# EAGLE design pi3_hat (EAGLE 6.5.0)
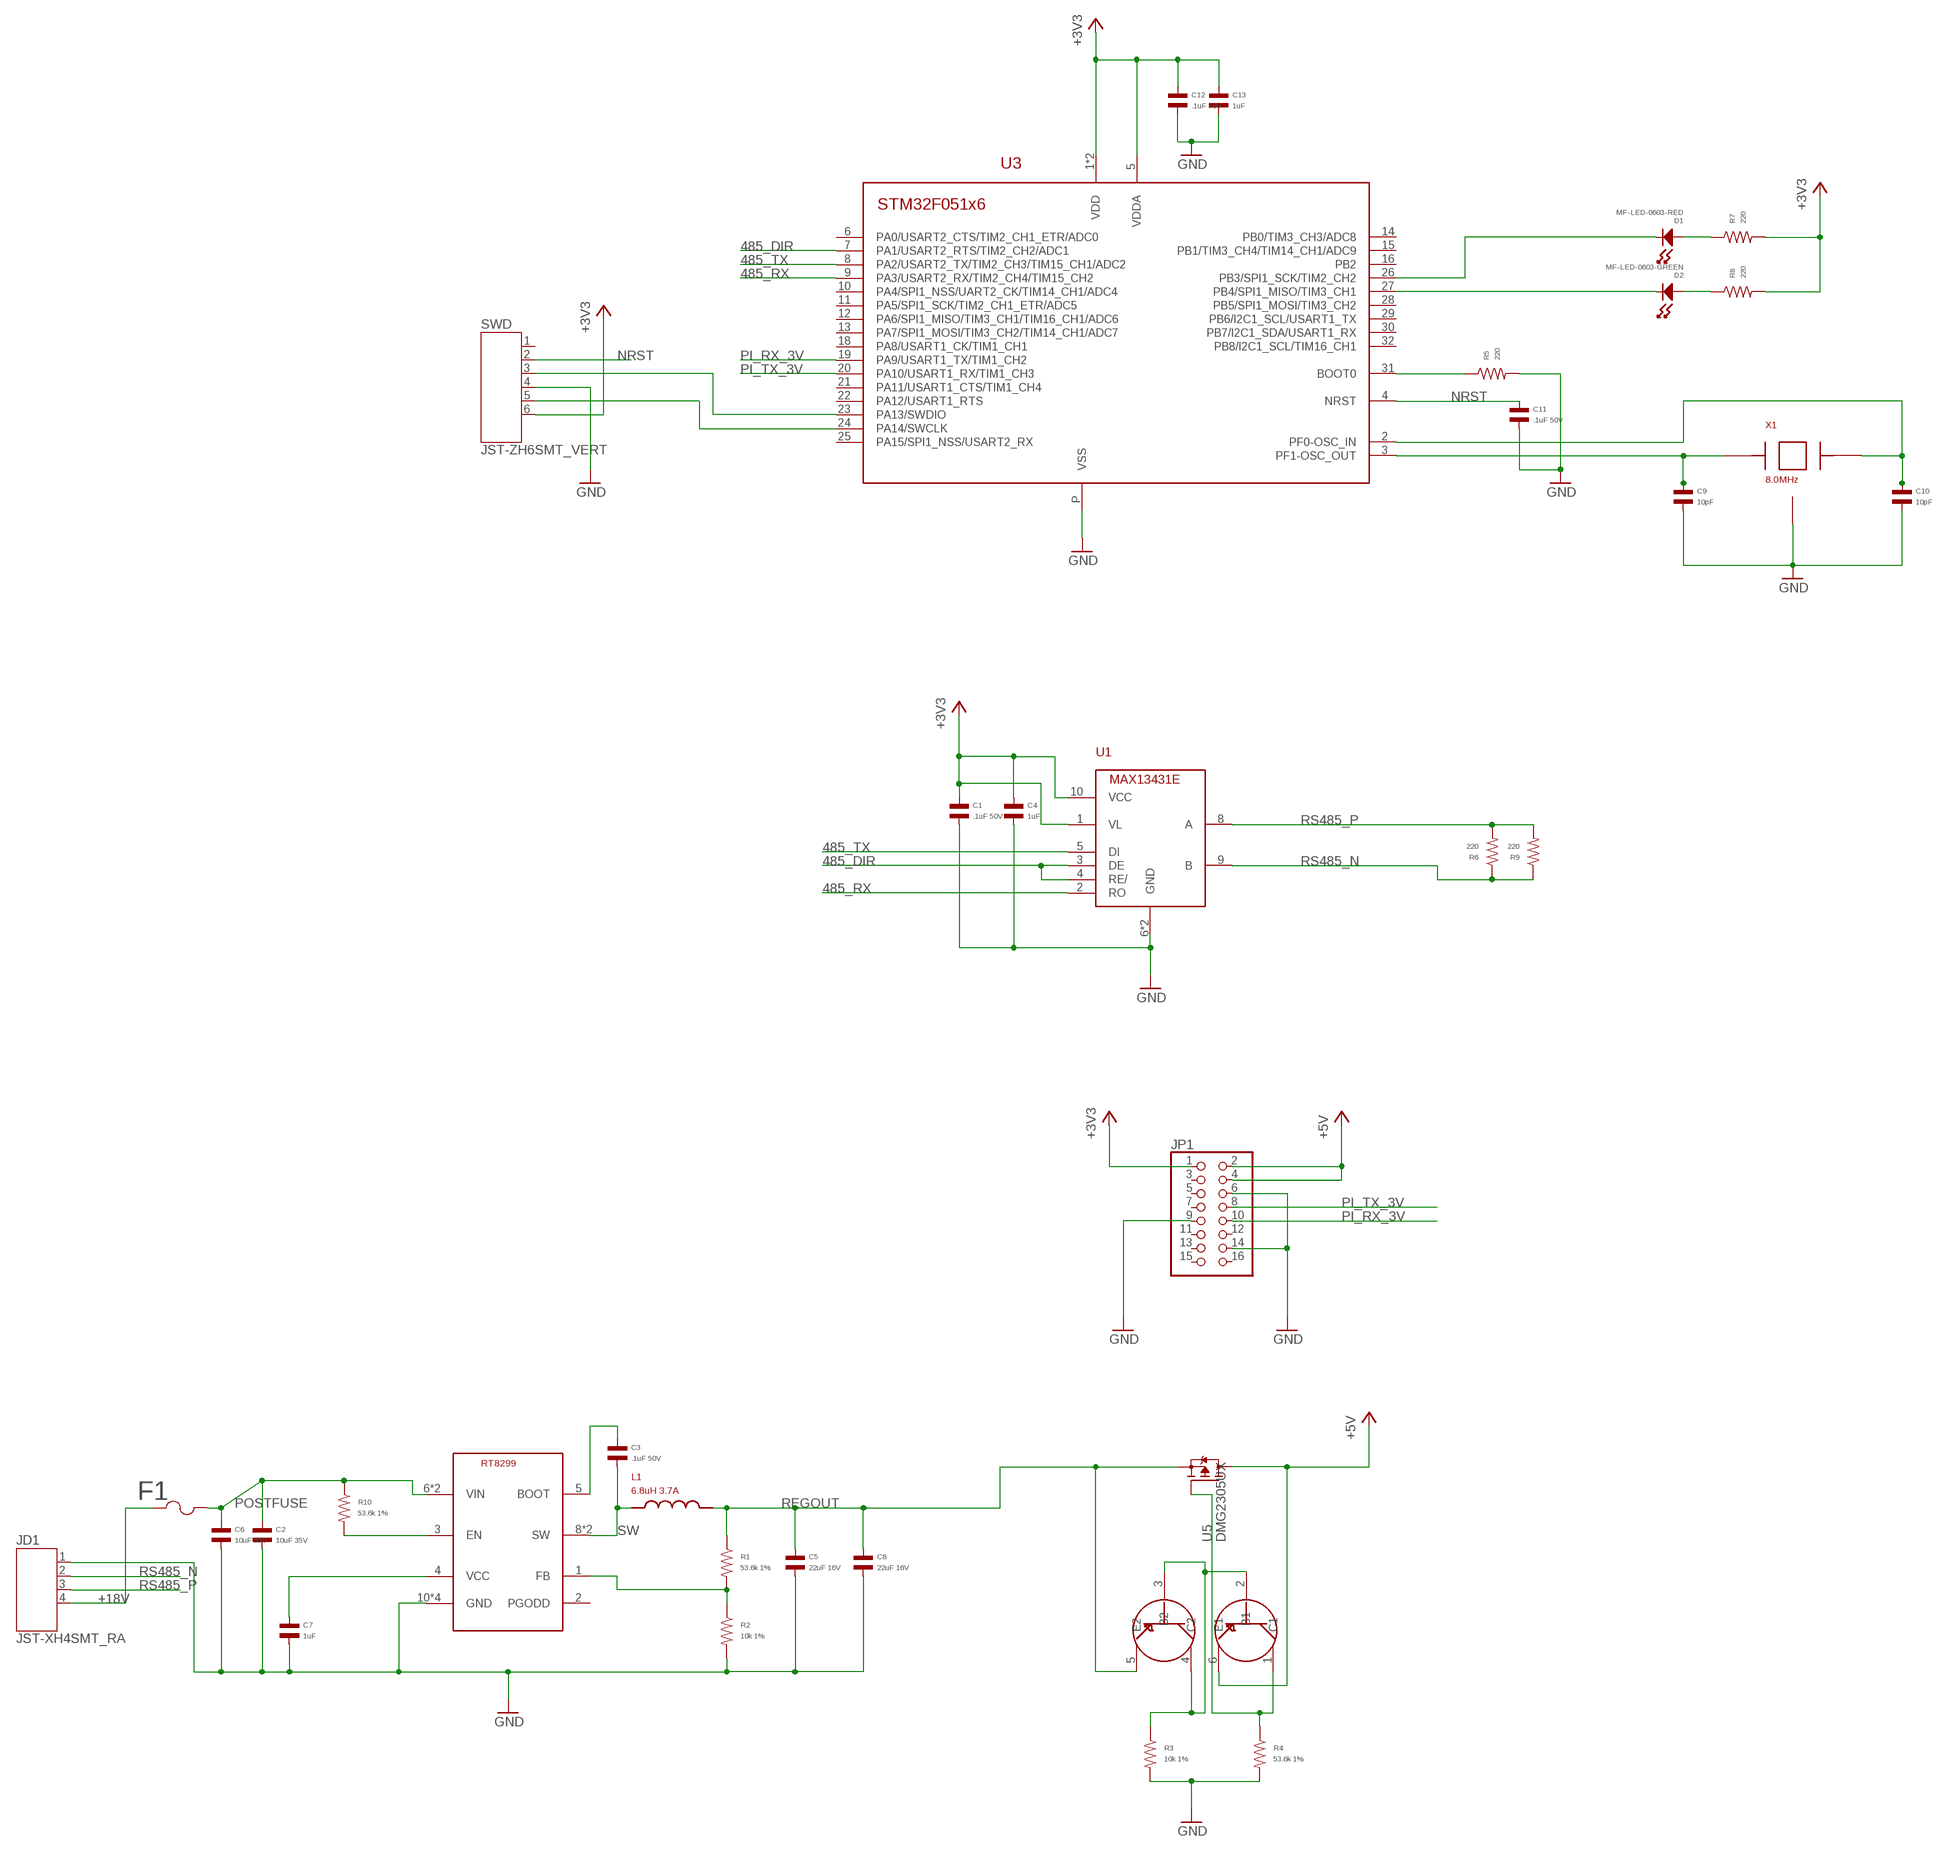
[diagram p0: schematic, sheet 1]

## Parts
C1  .1uF 50V  CAPACITOR_NP_0805  [C0805]
C2  10uF 35V  CAPACITOR_NP_1206  [C1206]
C3  .1uF 50V  CAPACITOR_NP_0805  [C0805]
C4  1uF  CAPACITOR_NP_0603  [C0603]
C5  22uF 16V  CAPACITOR_NP_1210  [C1210]
C6  10uF 35V  CAPACITOR_NP_1206  [C1206]
C7  1uF  CAPACITOR_NP_0603  [C0603]
C8  22uF 16V  CAPACITOR_NP_1210  [C1210]
C9  10pF  CAPACITOR_NP_0603  [C0603]
C10  10pF  CAPACITOR_NP_0603  [C0603]
C11  .1uF 50V  CAPACITOR_NP_0805  [C0805]
C12  .1uF 50V  CAPACITOR_NP_0805  [C0805]
C13  1uF  CAPACITOR_NP_0603  [C0603]
D1  MF-LED-0603-RED  LED_SINGLE-0603-RED  [LED0603]
D2  MF-LED-0603-GREEN  LED_SINGLE-0603-GREEN  [LED0603]
F1  MFU0603FF04000P100  [FUS_VISHAY_MFU0603]
JD1  JST-XH4SMT_RA  [JST_XH_SMT_RA_4]
JP1  PINHD-2X8  [2X08]
L1  6.8uH 3.7A  INDUCTORTAIYO_8040  [TAIYO_8040]
R1  53.6k 1%  RESISTOR_0603  [R0603]
R2  10k 1%  RESISTOR_0603  [R0603]
R3  10k 1%  RESISTOR_0603  [R0603]
R4  53.6k 1%  RESISTOR_0603  [R0603]
R5  220  RESISTOR_0603  [R0603]
R6  220  RESISTOR_0603  [R0603]
R7  220  RESISTOR_0603  [R0603]
R8  220  RESISTOR_0603  [R0603]
R9  220  RESISTOR_0603  [R0603]
R10  53.6k 1%  RESISTOR_0603  [R0603]
SWD  JST-ZH6SMT_VERT  [JST_B6B-ZR-SM4-TF(LF)(SN)]
U1  MAX13431E  [TDFN10]
U2  RT829910L_DFN  [10L_DFN]
U3  STM32F051X6UFQFPN32  [UFQFPN32]
U4  DMMT5401  [SOT26]
U5  DMG2305UX  [SOT23]
X1  8.0MHz  CRYSTALABM3B  [ABM3B]

## Nets
485_DIR: U1.3(DE) U1.4(RE/) U3.7(PA1/USART2_RTS/TIM2_CH2/ADC1)
485_RX: U1.2(RO) U3.9(PA3/USART2_RX/TIM2_CH4/TIM15_CH2)
485_TX: U1.5(DI) U3.8(PA2/USART2_TX/TIM2_CH3/TIM15_CH1/ADC2)
+3V3: C1.P$1 C4.P$1 C12.P$1 C13.P$1 JP1.1 R7.P$2 R8.P$2 SWD.6 U1.1(VL) U1.10(VCC) U3.1(VDD) U3.5(VDDA) U3.17(VDD)
+5V: JP1.2 JP1.4 U4.6(E1) U5.3(D)
+18V: F1.1 JD1.4
GND: C1.P$2 C2.P$2 C4.P$2 C5.P$2 C6.P$2 C7.P$2 C8.P$2 C9.P$2 C10.P$2 C11.P$2 C12.P$2 C13.P$2 JD1.1 JP1.6 JP1.9 JP1.14 R2.P$2 R3.P$2 R4.P$2 R5.P$2 SWD.4 U1.6(GND) U1.PAD(GND) U2.10(GND) U2.P0(GND) U2.P1(GND) U2.P2(GND) U3.P(VSS) X1.2 X1.4
N$1: R3.P$1 U4.2(B1) U4.3(B2) U4.4(C2)
N$2: C7.P$1 U2.4(VCC)
N$4: R5.P$1 U3.31(BOOT0)
N$5: R4.P$1 U4.1(C1) U5.1(G)
N$7: R10.P$2 U2.3(EN)
N$8: C3.P$1 U2.5(BOOT)
N$11: R1.P$2 R2.P$1 U2.1(FB)
N$12: SWD.5 U3.24(PA14/SWCLK)
N$13: SWD.3 U3.23(PA13/SWDIO)
N$15: D1.ANODE R7.P$1
N$16: D2.ANODE R8.P$1
N$17: D1.CATHODE U3.26(PB3/SPI1_SCK/TIM2_CH2)
N$18: D2.CATHODE U3.27(PB4/SPI1_MISO/TIM3_CH1)
N$35: C9.P$1 U3.3(PF1-OSC_OUT) X1.1
N$36: C10.P$1 U3.2(PF0-OSC_IN) X1.3
NRST: C11.P$1 SWD.2 U3.4(NRST)
PI_RX_3V: JP1.10 U3.19(PA9/USART1_TX/TIM1_CH2)
PI_TX_3V: JP1.8 U3.20(PA10/USART1_RX/TIM1_CH3)
POSTFUSE: C2.P$1 C6.P$1 F1.2 R10.P$1 U2.6(VIN) U2.7(VIN)
REGOUT: C5.P$1 C8.P$1 L1.2 R1.P$1 U4.5(E2) U5.2(S)
RS485_N: JD1.2 R6.P$1 R9.P$1 U1.9(B)
RS485_P: JD1.3 R6.P$2 R9.P$2 U1.8(A)
SW: C3.P$2 L1.1 U2.8(SW) U2.9(SW)
Unconnected: JP1.3 JP1.5 JP1.7 JP1.11 JP1.12 JP1.13 JP1.15 JP1.16 SWD.1 U2.2(PGODD) U3.6(PA0/USART2_CTS/TIM2_CH1_ETR/ADC0) U3.10(PA4/SPI1_NSS/UART2_CK/TIM14_CH1/ADC4) U3.11(PA5/SPI1_SCK/TIM2_CH1_ETR/ADC5) U3.12(PA6/SPI1_MISO/TIM3_CH1/TIM16_CH1/ADC6) U3.13(PA7/SPI1_MOSI/TIM3_CH2/TIM14_CH1/ADC7) U3.14(PB0/TIM3_CH3/ADC8) U3.15(PB1/TIM3_CH4/TIM14_CH1/ADC9) U3.16(PB2) U3.18(PA8/USART1_CK/TIM1_CH1) U3.21(PA11/USART1_CTS/TIM1_CH4) U3.22(PA12/USART1_RTS) U3.25(PA15/SPI1_NSS/USART2_RX) U3.28(PB5/SPI1_MOSI/TIM3_CH2) U3.29(PB6/I2C1_SCL/USART1_TX) U3.30(PB7/I2C1_SDA/USART1_RX) U3.32(PB8/I2C1_SCL/TIM16_CH1)

## Library data of the parts
C1 C3 C11 C12 = mfpassives:CAPACITOR_NP: Library: MF_Passives Description: Device for Non-Polarized Capacitors. Manufacture part number (MPN) can be added via Attributes. Check https://factory.macrofab.com/parts for the house parts list.; HOUSEPART: 1; MPN: MF-CAP-0805-0.1uF; POPULATE: 1
C2 C6 = mfpassives:CAPACITOR_NP: Library: MF_Passives Description: Device for Non-Polarized Capacitors. Manufacture part number (MPN) can be added via Attributes. Check https://factory.macrofab.com/parts for the house parts list.; MF: TDK; MPN: CGA5L1X7R1V106K160AC; POPULATE: 1
C4 C7 C13 = mfpassives:CAPACITOR_NP: Library: MF_Passives Description: Device for Non-Polarized Capacitors. Manufacture part number (MPN) can be added via Attributes. Check https://factory.macrofab.com/parts for the house parts list.; HOUSEPART: 1; MPN: MF-CAP-0603-1uF; POPULATE: 1
C5 C8 = mfpassives:CAPACITOR_NP: Library: MF_Passives Description: Device for Non-Polarized Capacitors. Manufacture part number (MPN) can be added via Attributes. Check https://factory.macrofab.com/parts for the house parts list.; MF: SAMSUNG; MPN: CL32A226KOJNNNE; POPULATE: 1
C9 C10 = mfpassives:CAPACITOR_NP: Library: MF_Passives Description: Device for Non-Polarized Capacitors. Manufacture part number (MPN) can be added via Attributes. Check https://factory.macrofab.com/parts for the house parts list.; HOUSEPART: 1; MF: MACROFAB; MPN: MF-CAP-0603-10pF; POPULATE: 1
D1 = mfleds:LED_SINGLE: Library: MF_LEDs Description: Device for Single LED Packages. Manufacture part number (MFG#) can be added via Attributes.; HOUSEPART: YES; MPN: MF-LED-0603-RED; POPULATE: 1; URL: https://factory.macrofab.com/part/MF-LED-0603-RED
D2 = mfleds:LED_SINGLE: Library: MF_LEDs Description: Device for Single LED Packages. Manufacture part number (MFG#) can be added via Attributes.; HOUSEPART: YES; MPN: MF-LED-0603-GREEN; POPULATE: 1; URL: https://factory.macrofab.com/part/MF-LED-0603-GREEN
F1 = pi3_hat:MFU0603FF04000P100; DPN: MFU06034.00CT-ND; MPN: MFU0603FF04000P100; POPULATE: 1; VENDOR: VISHAY
JD1 = odroid_shield:JST-XH4; DPN: 455-2262-1-ND; MF: JST; MPN: S4B-XH-SM4-TB(LF)(SN); POPULATE: 1
JP1 = pinhead:PINHD-2X8: PIN HEADER; POPULATE: 0
L1 = pi3_hat:INDUCTOR; HOUSEPART: 0; MF: TAIYO YUDEN; MPN: NR8040T6R8N; POPULATE: 1
R1 R4 R10 = mfpassives:RESISTOR: Library: MF_Passives Description: Device for Resistors. Manufacture part number (MPN), Voltage, Tolerance, and Wattage Rating can be added via Attributes. Check https://factory.macrofab.com/parts for the house parts list.; MF: Panasonic; MPN: ERJ-3EKF5362V; POPULATE: 1
R2 R3 = mfpassives:RESISTOR: Library: MF_Passives Description: Device for Resistors. Manufacture part number (MPN), Voltage, Tolerance, and Wattage Rating can be added via Attributes. Check https://factory.macrofab.com/parts for the house parts list.; MF: Panasonic; MPN: ERJ-3EKF1002V; POPULATE: 1
R5-R9 = mfpassives:RESISTOR: Library: MF_Passives Description: Device for Resistors. Manufacture part number (MPN), Voltage, Tolerance, and Wattage Rating can be added via Attributes. Check https://factory.macrofab.com/parts for the house parts list.; MPN: MF-RES-0603-220; POPULATE: 1
SWD = controller:JST-ZH6; MF: JST; MPN: B6B-ZR-SM4-TF(LF)(SN); POPULATE: 1
U1 = controller:MAX13431E; MF: Maxim; MPN: MAX13431EETB+T; POPULATE: 1
U2 = pi3_hat:RT8299; MF: Richtek; MPN: RT8299ZQW; POPULATE: 1
U3 = pi3_hat:STM32F051X6; MF: STMicroelectronics; MPN: STM32F051K6U6; POPULATE: 1
U4 = pi3_hat:DMMT5401; DPN: DMMT5401-FDICT-ND; MF: Didoes Incorporated; MPN: DMMT5401-7-F; POPULATE: 1
U5 = pi3_hat:DMG2305UX; DPN: DMG2305UX-13DICT-ND; MF: Diodes Incorporated; MPN: DMG2305UX-13; POPULATE: 1
X1 = controller:CRYSTAL; MF: Abracon; MPN: ABM3B-8.000MHZ-10-1-U-T; POPULATE: 1

## Board
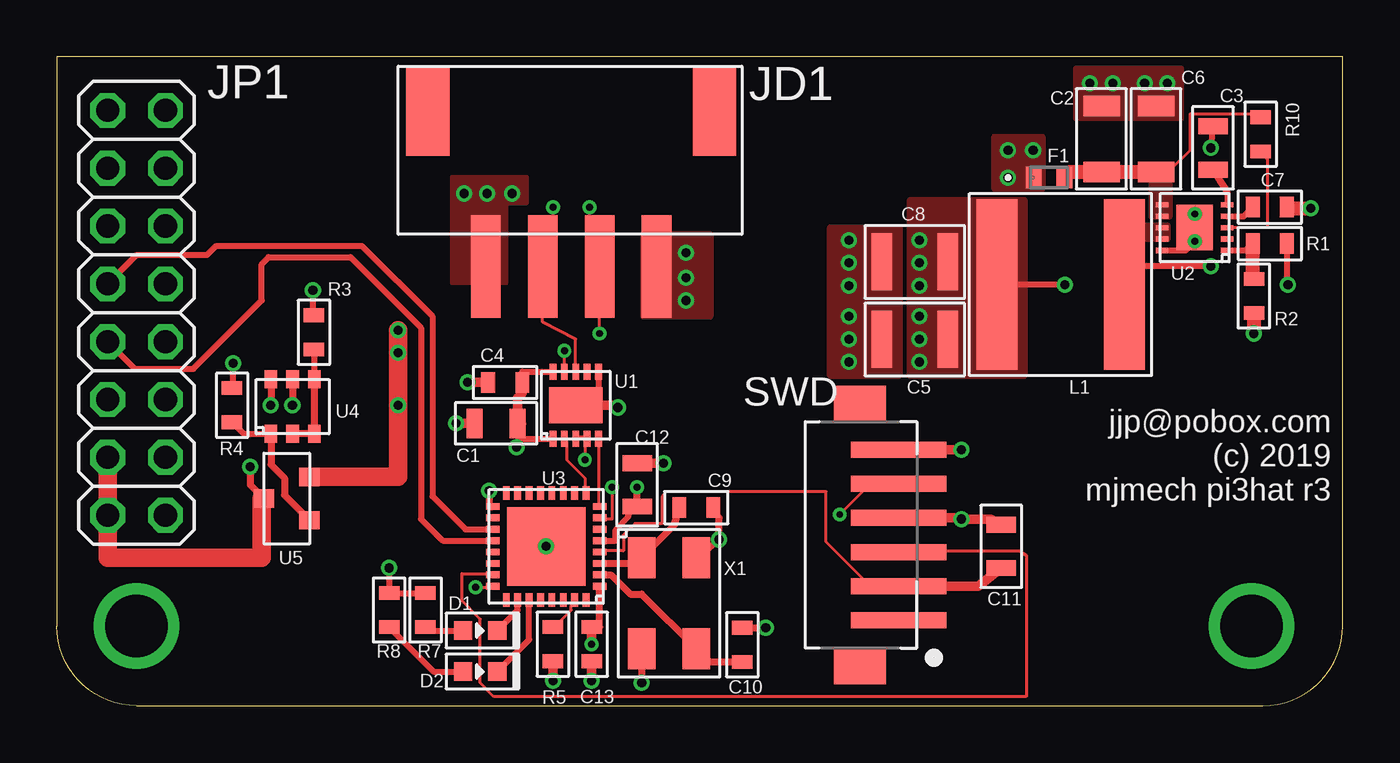
[diagram p1: board, top side]
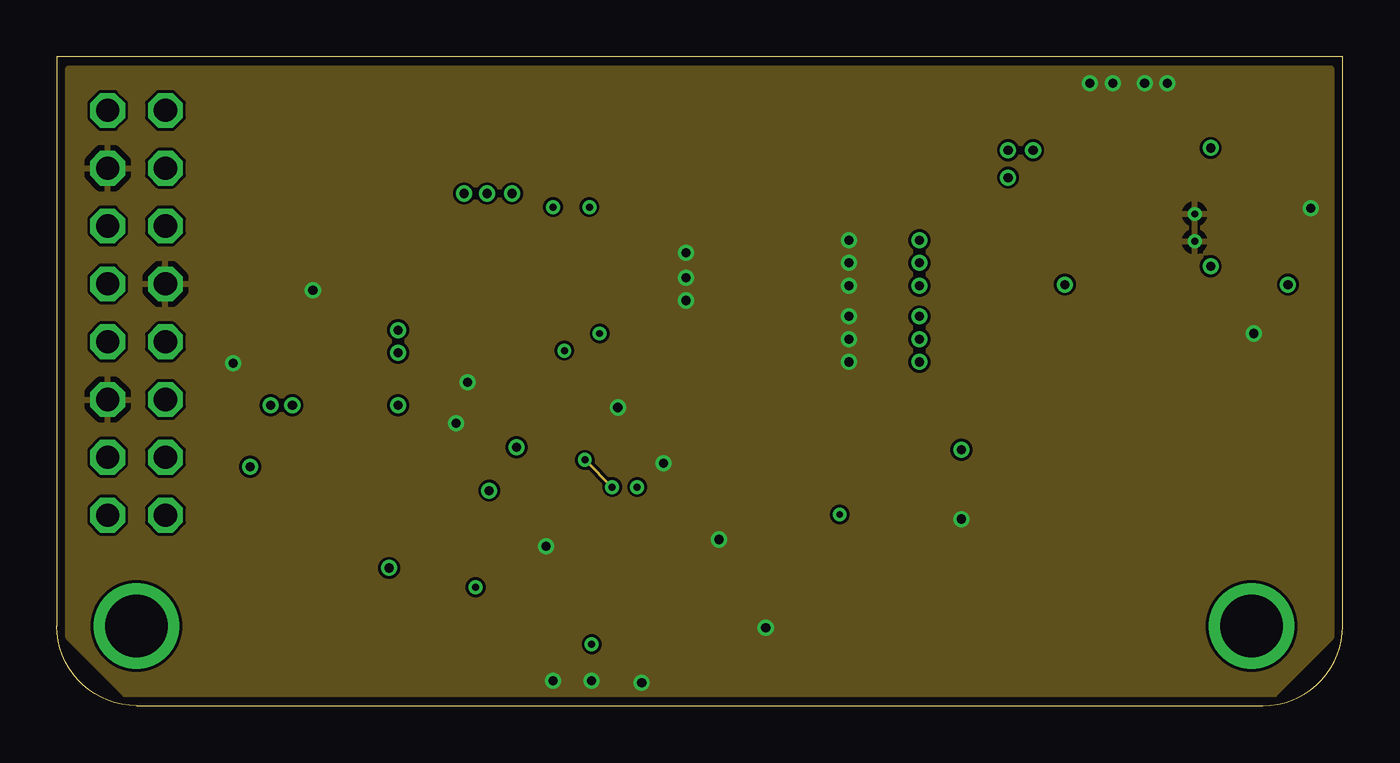
[diagram p2: board, inner layer Route2]
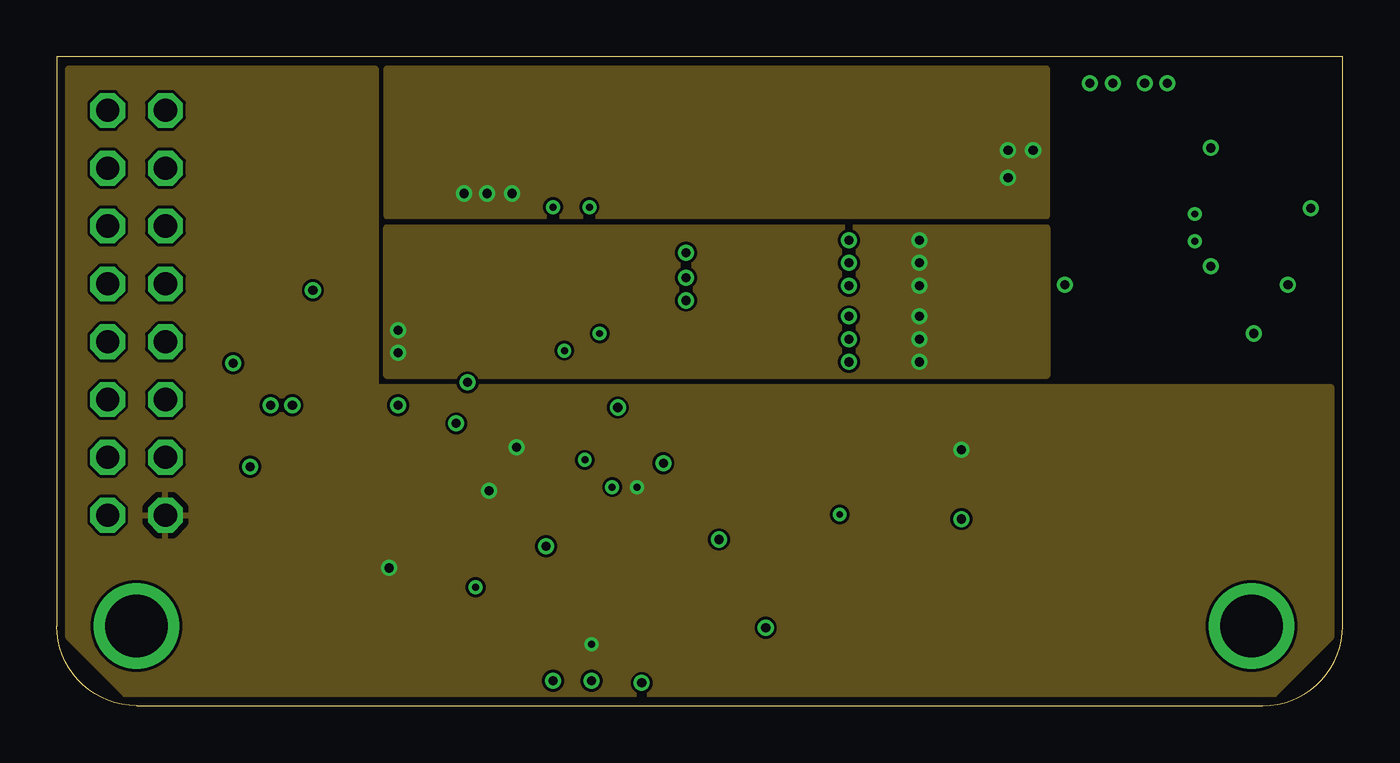
[diagram p3: board, inner layer Route15]
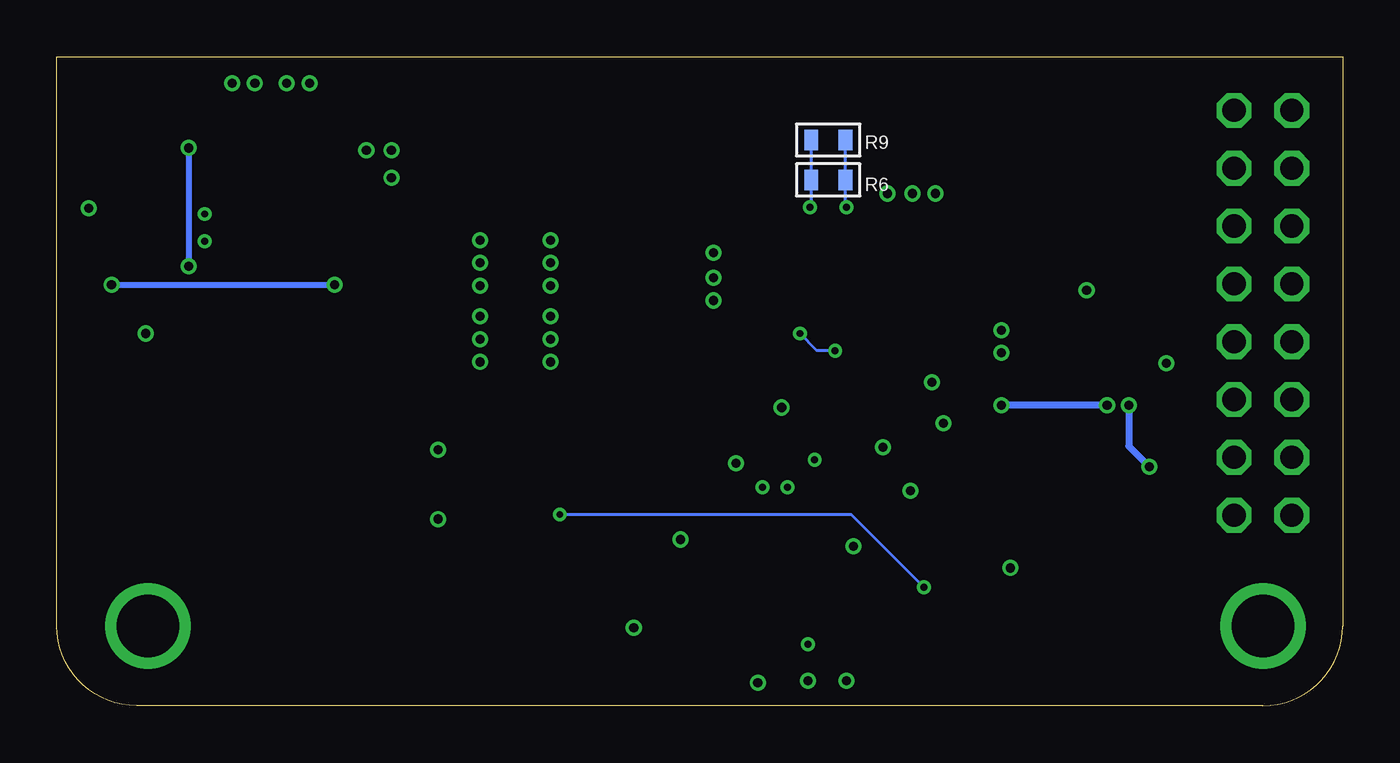
[diagram p4: board, bottom side, seen from below]

Size 56.5 x 28.5 mm. Coordinates in mm from the lower left corner, seen from the top.
Outline: 3.5,0 53,0 arc90 56.5,3.5 56.5,28.5 0,28.5 0,3.5 arc90 3.5,0
Copper layers (1*2*15*16): Top 0.035mm / dielectric 0.23mm / Route2 0.035mm / dielectric 0.93mm / Route15 0.035mm / dielectric 0.23mm / Bottom 0.035mm
Design rules "MF_Standard_4_Layer": minimum track width 5mil, minimum drill 12mil, track to track 5mil, track to pad 5mil, pad to pad 5mil, via to via 5mil, smd to smd 0mil, copper to edge 10mil, drill to drill 10mil, minimum pad ring 6mil, minimum via ring 6mil, stop-mask expansion 2mil, vias tented up to drill 25mil, thermal gap 10mil

### Footprints (pad centres in the part's own frame; a part is rotated, then mirrored left to right if it is on the bottom)
C0805 = smd 0.7 x 1.3: P$1 -0.95,0; P$2 0.95,0
C1206 = smd 0.9 x 1.6: P$1 -1.45,0; P$2 1.45,0
C0603 = smd 0.6 x 0.9: P$1 -0.75,0; P$2 0.75,0
C1210 = smd 0.9 x 2.5: P$1 -1.45,0; P$2 1.45,0
LED0603 = smd 0.8 x 0.8: ANODE 0.75,0; CATHODE -0.75,0
FUS_VISHAY_MFU0603 = smd 0.699 x 0.94: 1 -0.679,0; 2 0.679,0
JST_XH_SMT_RA_4 = smd 1.3 x 4.5: 1 -3.75,4.6; 2 -1.25,4.6; 3 1.25,4.6; 4 3.75,4.6 | smd 1.9 x 3.9: SHLD1 -6.3,-2.2; SHLD2 6.3,-2.2
2X08 = drill 1.016 octagon: 1 -8.89,-1.27; 2 -8.89,1.27; 3 -6.35,-1.27; 4 -6.35,1.27; 5 -3.81,-1.27; 6 -3.81,1.27; 7 -1.27,-1.27; 8 -1.27,1.27; 9 1.27,-1.27; 10 1.27,1.27; 11 3.81,-1.27; 12 3.81,1.27; 13 6.35,-1.27; 14 6.35,1.27; 15 8.89,-1.27; 16 8.89,1.27
TAIYO_8040 = smd 1.8 x 7.5: 1 -2.8,0; 2 2.8,0
R0603 = smd 0.6 x 0.9: P$1 -0.75,0; P$2 0.75,0
JST_B6B-ZR-SM4-TF(LF)(SN) = smd 0.7 x 4.2: 1 -3.75,-2; 2 -2.25,-2; 3 -0.75,-2; 4 0.75,-2; 5 2.25,-2; 6 3.75,-2 | smd 1.5 x 2.3: P1 -5.8,-0.29; P2 5.8,-0.29
TDFN10 = smd 0.7 x 0.3: 1 -1.475,1; 2 -1.475,0.5; 3 -1.475,0; 4 -1.475,-0.5; 5 -1.475,-1; 6 1.475,-1; 7 1.475,-0.5; 8 1.475,0; 9 1.475,0.5; 10 1.475,1 | smd 1.58 x 2.35: PAD 0,0
10L_DFN = smd 0.55 x 0.23: 1 -1.425,1; 2 -1.425,0.5; 3 -1.425,0; 4 -1.425,-0.5; 5 -1.425,-1; 6 1.425,-1; 7 1.425,-0.5; 8 1.425,0; 9 1.425,0.5; 10 1.425,1 | smd 1.6 x 2: P0 0,0 | drill 0.305: P1 0,0.6; P2 0,-0.6
UFQFPN32 = smd 0.6 x 0.3: 1 -2.35,1.75; 2 -2.35,1.25; 3 -2.35,0.75; 4 -2.35,0.25; 5 -2.35,-0.25; 6 -2.35,-0.75; 7 -2.35,-1.25; 8 -2.35,-1.75; 17 2.35,-1.75; 18 2.35,-1.25; 19 2.35,-0.75; 20 2.35,-0.25; 21 2.35,0.25; 22 2.35,0.75; 23 2.35,1.25; 24 2.35,1.75 | smd 0.3 x 0.6: 9 -1.75,-2.35; 10 -1.25,-2.35; 11 -0.75,-2.35; 12 -0.25,-2.35; 13 0.25,-2.35; 14 0.75,-2.35; 15 1.25,-2.35; 16 1.75,-2.35; 25 1.75,2.35; 26 1.25,2.35; 27 0.75,2.35; 28 0.25,2.35; 29 -0.25,2.35; 30 -0.75,2.35; 31 -1.25,2.35; 32 -1.75,2.35 | smd 3.45 x 3.45: P 0,0
SOT26 = smd 0.55 x 0.8: 1 -0.95,-1.2; 2 0,-1.2; 3 0.95,-1.2; 4 0.95,1.2; 5 0,1.2; 6 -0.95,1.2
SOT23 = smd 0.8 x 0.9: 1 -0.95,-1; 2 0.95,-1; 3 0,1
ABM3B = smd 1.8 x 1.2: 1 -2,-1.2; 2 2,-1.2; 3 2,1.2; 4 -2,1.2

### Placement (x,y rotation side)
C1  19.3,12.4 180 top
C2  45.9,24.9 90 top
C3  50.8,24.5 90 top
C4  19.7,14.2 180 top
C5  37.7,16.1 180 top
C6  48.3,24.9 90 top
C7  53.3,21.9 0 top
C8  37.7,19.5 180 top
C9  28.1,8.7 0 top
C10  30.12,2.67 90 top
C11  41.5,7 90 top
C12  25.5,9.7 90 top
C13  23.5,2.7 270 top
D1  18.6,3.3 180 top
D2  18.6,1.5 180 top
F1  43.6,23.2 0 top
JD1  22.6,23.9 180 top
JP1  3.5,17.26 90 top
L1  44.1,18.5 180 top
R1  53.3,20.3 180 top
R2  52.6,18 270 top
R3  11.3,16.4 90 top
R4  7.7,13.2 90 top
R5  21.8,2.7 270 top
R6  22.6,23.1 0 bottom
R7  16.2,4.2 90 top
R8  14.6,4.2 90 top
R9  22.6,24.85 0 bottom
R10  52.9,25.1 270 top
SWD  35,7.5 90 top
U1  22.8,13.2 90 top
U2  50,21 180 top
U3  21.5,7 180 top
U4  10.36,13.14 0 top
U5  10.1,9.1 90 top
X1  26.9,4.5 270 top

### Tracks (layer width: path | path; a pad name or v marks a point on that pad's centre or on a via)
485_DIR  (via drill 0.3)
  Top 0.127: U1.3 22.8,11.8 23.2,11.8 U1.4 23.2,11.6 v23.2,10.8 | v24.4,9.6 24.4,8.2 24,8.2 U3.7
  Route2 0.127: v23.2,10.8 v24.4,9.6
485_RX
  Top 0.127: U3.9 23.2,9.4 23.2,10 22.4,10.8 22.4,11.6 U1.2
485_TX
  Top 0.127: U1.5 23.8,8.8 U3.8
+3V3  (via drill 0.3, 0.4)
  Top 0.254: v14.6,6.05 R8.P$2 R7.P$2 | C4.P$1 20.45,14.68 U1.10 | C1.P$1 20.5,12.4 v20.2,11.35 20.3,11.7 20.32,11.72 U1.1 | U3.5 24.55,7.25 24.55,7.72 25.1,8.3 25.18,8.57 25.5,8.57 C12.P$1
  Top 0.305: C13.P$1 23.85,3.45 U3.1 | v19,9.45 19,8.75 U3.17 | C12.P$1 v25.5,9.6
  Top 0.406: C13.P$1 v23.5,2.7 | SWD.6 v39.75,11.25 | C1.P$1 20.25,13.53 20.45,13.72 C4.P$1
  pour Route15: 0.5,28 14,28 14,14 56,14 56,3 53.5,0.5 3,0.5 0.5,3
+5V  (via drill 0.4)
  Top 0.305: U4.6 v9.41,13.21 v9.4,13.2 | v8.5,10.5 8.5,9.7 U5.3
  Top 0.813: U5.3 9,9.1 9,6.5 2.23,6.5 JP1.2 JP1.4
  Bottom 0.305: v9.4,13.2 9.4,11.4 v8.5,10.5
+18V  (via drill 0.4)
  other vias: 17.9,22.5 18.9,22.5 20,22.5 41.8,23.2 41.8,24.4 42.9,24.4
  pour Route15: 14.5,28 43.5,28 43.5,21.5 14.5,21.5
  pour Top (no thermals): 17.4,23.2 20.6,23.2 20.6,22.1 19.7,22.1 19.7,18.6 17.4,18.6
  pour Top (no thermals): 41.2,25 43.3,25 43.3,22.7 41.2,22.7
GND  (via drill 0.4)
  Top 0.127: U2.P2 U2.P0
  Top 0.254: U1.6 23.8,13.2 U1.PAD | U2.10 49.6,20 U2.P1 | R3.P$2 11.25,17.2 v11.25,18.25 | R4.P$2 7.75,14 v7.75,15.05
  Top 0.305: C10.P$2 v31.15,3.42 | X1.4 v29.1,7.3 29.1,8.25 C9.P$2 | X1.2 v25.7,1
  Top 0.406: R5.P$2 v21.8,1.1 | C13.P$2 v23.5,1.1 | C12.P$2 v26.65,10.65 | SWD.4 39.7,8.25 v39.75,8.2 41.05,8.2 C11.P$2 | v18.05,14.2 C4.P$2 | v17.55,12.4 C1.P$2 | v24.65,13.1 24.55,13.2 U1.PAD
  Top 0.61: C7.P$2 54.1,21.85 v55.1,21.85 | R2.P$2 v52.6,16.35
  other vias: 21.5,7 34.8,16.1 34.8,17.1 34.8,18.45 34.8,19.45 34.8,15.1 34.8,20.45 27.65,17.8 27.65,19.9 27.65,18.8 45.4,27.35 46.4,27.35 47.8,27.35 48.8,27.35
  pour Route2: 0.5,28 56,28 56,3 53.5,0.5 3,0.5 0.5,3
  pour Top (no thermals): 34,21 37,21 37,14.5 34,14.5
  pour Top (no thermals): 25.8,20.7 28.7,20.7 28.7,17.1 25.8,17.1
  pour Top (no thermals): 44.8,28 49.4,28 49.4,25.8 44.8,25.8
N$1
  Top 0.254: R3.P$1 U4.4
  Top 0.305: U4.4 U4.3 U4.2
N$2
  Top 0.254: U2.4 52.15,21.5 C7.P$1
N$3  (via drill 2.75)
  other vias: 3.5,3.5
N$4
  Top 0.127: U3.31 22.8,4.6 22.6,4.4 22.6,4.2 21.8,3.4 R5.P$1
N$5
  Top 0.254: R4.P$1 8.21,11.94 U4.1
  Top 0.305: 9.41,12.06 U4.1 9.41,10.59 10,10 10,9.25 U5.1
N$6  (via drill 2.75)
  other vias: 52.5,3.5
N$7
  Top 0.127: U2.3 53.2,21 53.2,24 53,24.2 R10.P$2
N$8
  Top 0.254: 51.4,22.6 51.42,22.57 U2.5
  Top 0.305: C3.P$1 51.4,22.65 51.4,22.6
N$11
  Top 0.254: U2.1 52.25,20 R1.P$2
  Top 0.61: R2.P$1 52.55,18.8 R1.P$2
N$12  (via drill 0.3)
  Top 0.127: v18.4,5.2 19,5.2 U3.24 | v34.4,8.4 35.6,9.6 37,9.6 SWD.5
  Bottom 0.127: v18.4,5.2 21.6,8.4 v34.4,8.4
N$13
  Top 0.127: U3.23 19,5.8 17.8,5.8 17.8,4.6 18.6,3.8 18.6,1 19.2,0.4 42.6,0.4 42.6,6.6 42.3,6.8 37,6.8 SWD.3
N$15
  Top 0.254: R7.P$1 16.35,3.3 D1.ANODE
N$16
  Top 0.254: R8.P$1 16.55,1.5 D2.ANODE
N$17
  Top 0.254: D1.CATHODE 20.25,4.2 U3.26
N$18
  Top 0.254: D2.CATHODE 20.75,2.9 U3.27
N$35
  Top 0.305: U3.3 25.45,6.25 arc90 X1.1 27.15,7.95 C9.P$1
N$36
  Top 0.305: U3.2 24.35,5.75 25.2,4.9 25.7,4.9 X1.3 28.68,1.93 C10.P$1
NRST
  Top 0.127: U3.4 24,6.8 24.9,6.8 24.9,7.5 25.4,8 26.6,8 26.6,9.2 26.8,9.4 33.8,9.4 33.8,7.2 35.8,5.2 36.8,5.2 SWD.2
  Top 0.406: C11.P$1 40.5,5.25 SWD.2
PI_RX_3V
  Top 0.254: JP1.10 3.5,19.8 6.6,19.8 7,20.2 13.4,20.2 16.5,17.1 16.5,9.2 17.95,7.75 U3.19
PI_TX_3V
  Top 0.254: JP1.8 3.42,14.8 6,14.8 9,17.8 9,19.4 9.3,19.7 12.9,19.7 16,16.6 16,8.2 16.95,7.25 U3.20
POSTFUSE
  Top 0.127: R10.P$1 52.8,26 49.8,26 49.8,24.4 49,23.6 C6.P$1
  Top 0.61: F1.2 44.53,23.45 C2.P$1 C6.P$1
  pour Top (no thermals): 48.1,23.6 48.1,21.5 48.9,21.5 48.9,23.6
REGOUT  (via drill 0.4)
  Top 0.254: R1.P$1 54.05,18.55 v54.1,18.5 | v44.3,18.5 L1.2
  Top 0.305: U4.5 v10.36,13.21 v10.35,13.2
  Top 0.813: U5.2 15,10.05 v15,13.2 v15,15.5 v15,16.5
  Bottom 0.254: v54.1,18.5 v44.3,18.5
  Bottom 0.305: v10.35,13.2 v15,13.2
  other vias: 37.9,20.45 37.9,19.45 37.9,18.45 37.9,17.1 37.9,16.1 37.9,15.1
  pour Top (no thermals): 37.5,22.2 42.5,22.2 42.5,14.5 37.5,14.5
  pour Route15 (no thermals): 14.5,21 43.5,21 43.5,14.5 14.5,14.5
RS485_N  (via drill 0.3)
  Top 0.127: U1.9 v22.3,15.6 | v23.85,16.35 JD1.2 23.4,19.75 v23.4,21.9
  Bottom 0.127: v22.3,15.6 23.1,15.6 v23.85,16.35 | v23.4,21.9 23.35,21.95 R6.P$1 R9.P$1
RS485_P  (via drill 0.3)
  Top 0.127: U1.8 22.8,16.1 21.35,16.85 JD1.3 21.8,19.75 v21.8,21.9
  Bottom 0.127: v21.8,21.9 21.85,21.95 R6.P$2 R9.P$2
SW  (via drill 0.4)
  Top 0.254: C3.P$2 v50.7,24.5 | v50.7,19.3 47.7,19.3 L1.1
  Bottom 0.254: v50.7,24.5 v50.7,19.3
  pour Top (no thermals): 46.5,21.1 48.8,21.1 48.8,20.5 47.6,20.5 47.6,18.2 46.5,18.2

### Text on the board
tPlace: jjp@pobox.com | (c) 2019 | mjmech pi3hat r3